# EAGLE schematic axiom_beta_interface_dummy_v0.8 (EAGLE 7.0.0)

## Sheet 1 of 2
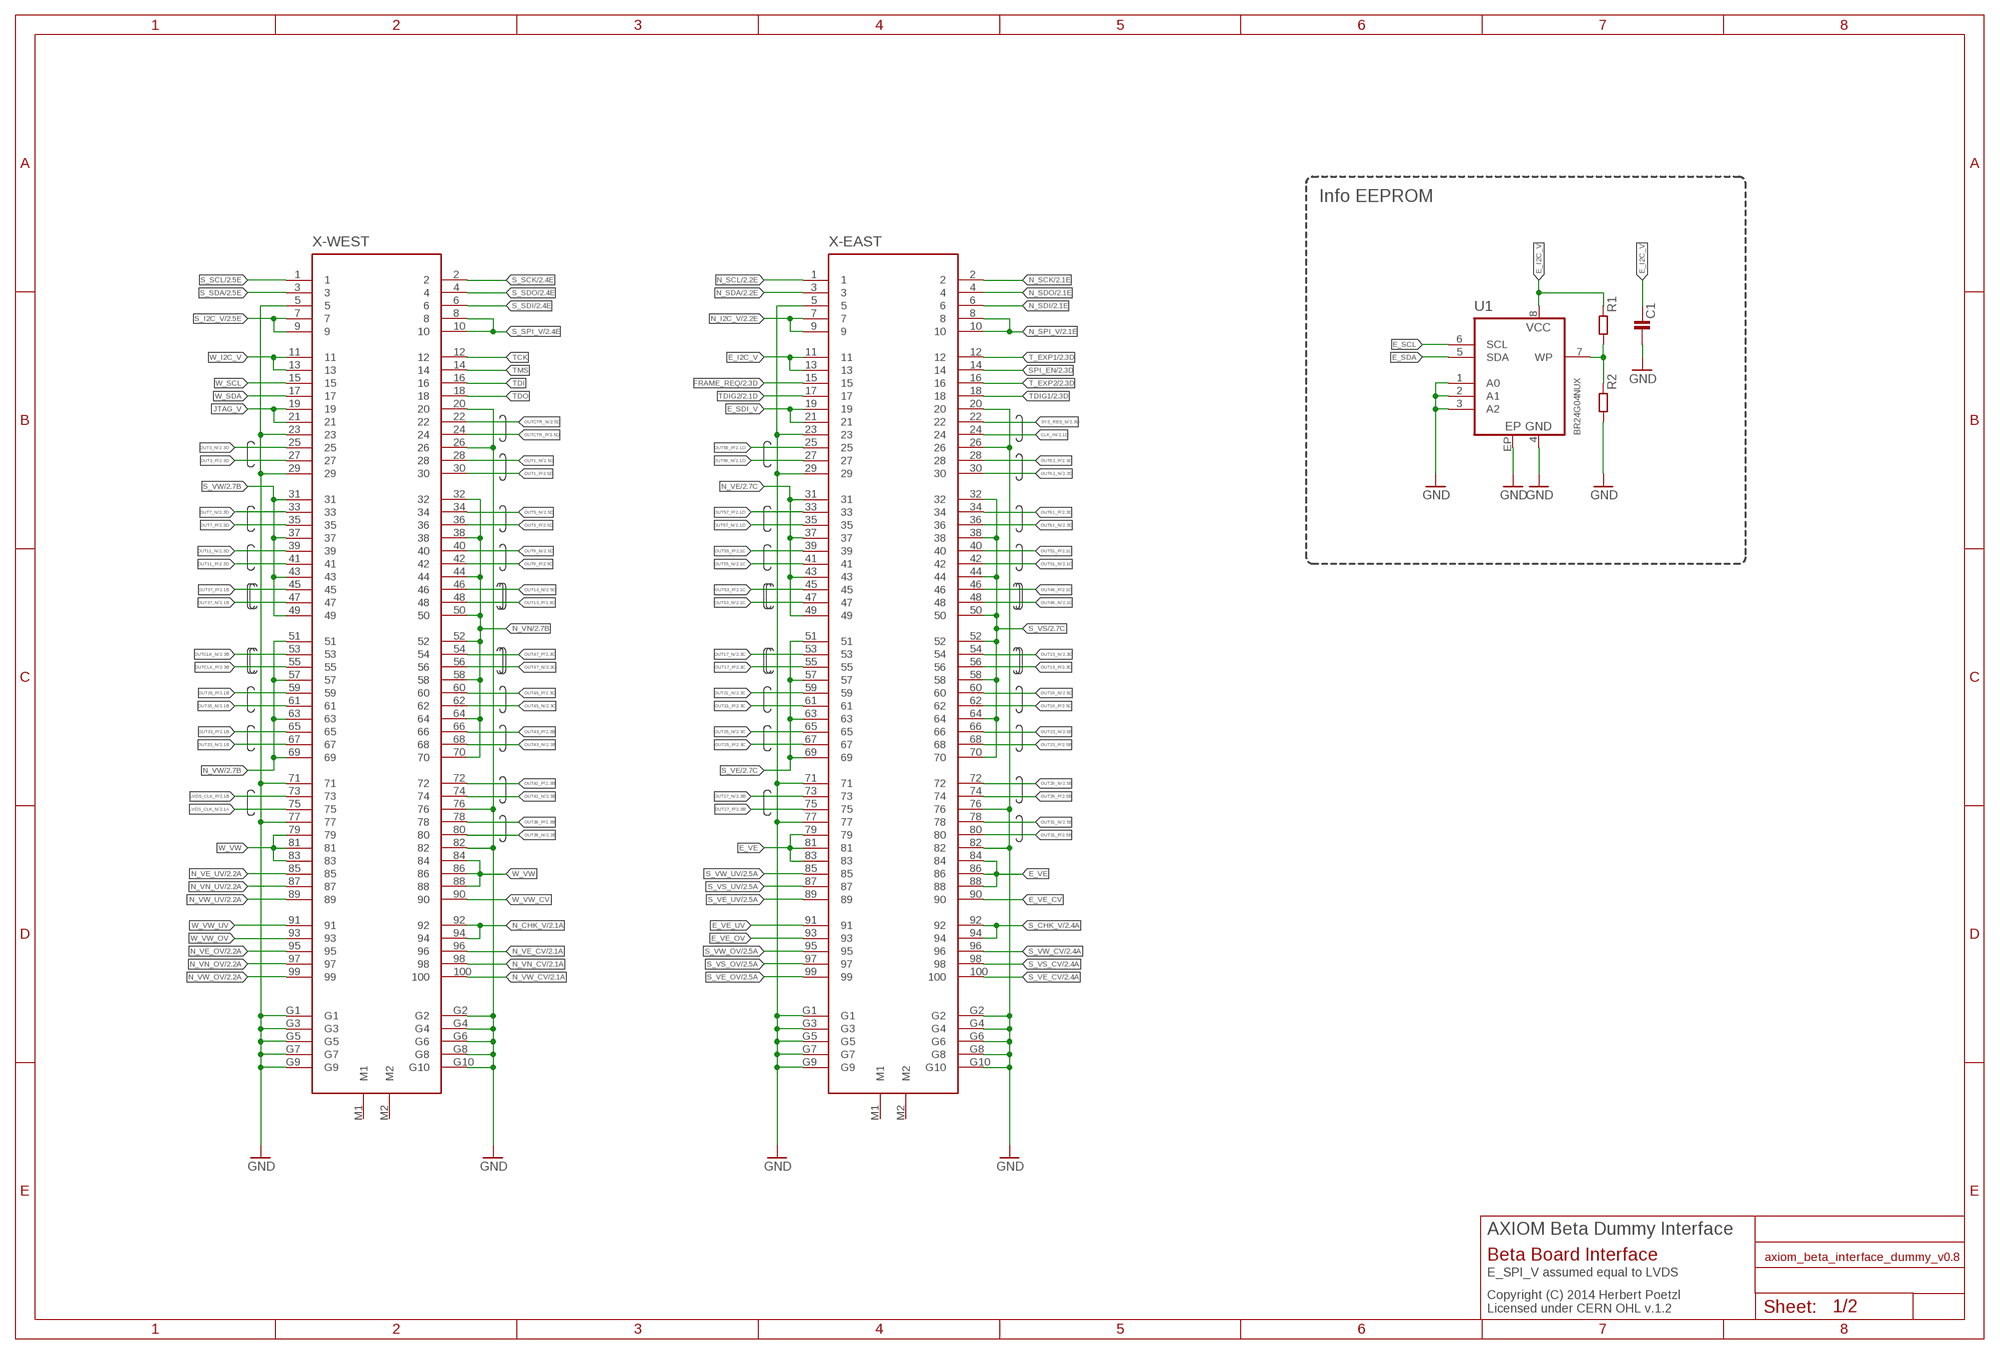
[diagram p0: schematic, sheet 1]

### Parts
C1  C0402-B  [0402-B]
R1  R0402-B  [0402-B]
R2  R0402-B  [0402-B]
U1  BR24G04NUX  [DFN200X300X100-9N]
X-EAST  FX10-100/10P  [FX10A-100P/10]
X-WEST  FX10-100/10P  [FX10A-100P/10]

### Nets
CLK_IN: X-EAST.24 ; also sheet 2
E_I2C_V: C1.1 R1.1 U1.8(VCC) X-EAST.11 X-EAST.13
E_SCL: U1.6(SCL)
E_SDA: U1.5(SDA)
E_SDI_V: X-EAST.19 X-EAST.21
E_VE: X-EAST.79 X-EAST.81 X-EAST.83 X-EAST.84 X-EAST.86 X-EAST.88
E_VE_CV: X-EAST.90
E_VE_OV: X-EAST.93
E_VE_UV: X-EAST.91
FRAME_REQ: X-EAST.15 ; also sheet 2
GND [power]: C1.2 R2.2 U1.1(A0) U1.2(A1) U1.3(A2) U1.4(GND) U1.EP X-EAST.5 X-EAST.20 X-EAST.23 X-EAST.26 X-EAST.29 X-EAST.71 X-EAST.76 X-EAST.77 X-EAST.82 X-EAST.G1 X-EAST.G2 X-EAST.G3 X-EAST.G4 X-EAST.G5 X-EAST.G6 X-EAST.G7 X-EAST.G8 X-EAST.G9 X-EAST.G10 X-WEST.5 X-WEST.20 X-WEST.23 X-WEST.26 X-WEST.29 X-WEST.71 X-WEST.76 X-WEST.77 X-WEST.82 X-WEST.G1 X-WEST.G2 X-WEST.G3 X-WEST.G4 X-WEST.G5 X-WEST.G6 X-WEST.G7 X-WEST.G8 X-WEST.G9 X-WEST.G10 ; also sheet 2
JTAG_V: X-WEST.19 X-WEST.21
LVDS_CLK_N: X-WEST.75 ; also sheet 2
LVDS_CLK_P: X-WEST.73 ; also sheet 2
N$12: R1.2 R2.1 U1.7(WP)
N_CHK_V: X-WEST.92 X-WEST.94 ; also sheet 2
N_I2C_V: X-EAST.7 X-EAST.9 ; also sheet 2
N_SCK: X-EAST.2 ; also sheet 2
N_SCL: X-EAST.1 ; also sheet 2
N_SDA: X-EAST.3 ; also sheet 2
N_SDI: X-EAST.6 ; also sheet 2
N_SDO: X-EAST.4 ; also sheet 2
N_SPI_V: X-EAST.8 X-EAST.10 ; also sheet 2
N_VE [power]: X-EAST.31 X-EAST.37 X-EAST.43 X-EAST.49 ; also sheet 2
N_VE_CV: X-WEST.96 ; also sheet 2
N_VE_OV: X-WEST.95 ; also sheet 2
N_VE_UV: X-WEST.85 ; also sheet 2
N_VN [power]: X-WEST.32 X-WEST.38 X-WEST.44 X-WEST.50 X-WEST.52 X-WEST.58 X-WEST.64 X-WEST.70 ; also sheet 2
N_VN_CV: X-WEST.98 ; also sheet 2
N_VN_OV: X-WEST.97 ; also sheet 2
N_VN_UV: X-WEST.87 ; also sheet 2
N_VW [power]: X-WEST.51 X-WEST.57 X-WEST.63 X-WEST.69 ; also sheet 2
N_VW_CV: X-WEST.100 ; also sheet 2
N_VW_OV: X-WEST.99 ; also sheet 2
N_VW_UV: X-WEST.89 ; also sheet 2
OUT1_N: X-WEST.28 ; also sheet 2
OUT1_P: X-WEST.30 ; also sheet 2
OUT3_N: X-WEST.25 ; also sheet 2
OUT3_P: X-WEST.27 ; also sheet 2
OUT5_N: X-WEST.34 ; also sheet 2
OUT5_P: X-WEST.36 ; also sheet 2
OUT7_N: X-WEST.33 ; also sheet 2
OUT7_P: X-WEST.35 ; also sheet 2
OUT9_N: X-WEST.40 ; also sheet 2
OUT9_P: X-WEST.42 ; also sheet 2
OUT11_N: X-WEST.39 ; also sheet 2
OUT11_P: X-WEST.41 ; also sheet 2
OUT13_N: X-WEST.46 ; also sheet 2
OUT13_P: X-WEST.48 ; also sheet 2
OUT15_N: X-EAST.54 ; also sheet 2
OUT15_P: X-EAST.56 ; also sheet 2
OUT17_N: X-EAST.53 ; also sheet 2
OUT17_P: X-EAST.55 ; also sheet 2
OUT19_N: X-EAST.60 ; also sheet 2
OUT19_P: X-EAST.62 ; also sheet 2
OUT21_N: X-EAST.59 ; also sheet 2
OUT21_P: X-EAST.61 ; also sheet 2
OUT23_N: X-EAST.66 ; also sheet 2
OUT23_P: X-EAST.68 ; also sheet 2
OUT25_N: X-EAST.65 ; also sheet 2
OUT25_P: X-EAST.67 ; also sheet 2
OUT27_N: X-EAST.73 ; also sheet 2
OUT27_P: X-EAST.75 ; also sheet 2
OUT29_N: X-EAST.72 ; also sheet 2
OUT29_P: X-EAST.74 ; also sheet 2
OUT31_N: X-EAST.78 ; also sheet 2
OUT31_P: X-EAST.80 ; also sheet 2
OUT33_N: X-WEST.67 ; also sheet 2
OUT33_P: X-WEST.65 ; also sheet 2
OUT35_N: X-WEST.61 ; also sheet 2
OUT35_P: X-WEST.59 ; also sheet 2
OUT37_N: X-WEST.47 ; also sheet 2
OUT37_P: X-WEST.45 ; also sheet 2
OUT39_N: X-WEST.80 ; also sheet 2
OUT39_P: X-WEST.78 ; also sheet 2
OUT41_N: X-WEST.74 ; also sheet 2
OUT41_P: X-WEST.72 ; also sheet 2
OUT43_N: X-WEST.68 ; also sheet 2
OUT43_P: X-WEST.66 ; also sheet 2
OUT45_N: X-WEST.62 ; also sheet 2
OUT45_P: X-WEST.60 ; also sheet 2
OUT47_N: X-WEST.56 ; also sheet 2
OUT47_P: X-WEST.54 ; also sheet 2
OUT49_N: X-EAST.48 ; also sheet 2
OUT49_P: X-EAST.46 ; also sheet 2
OUT51_N: X-EAST.42 ; also sheet 2
OUT51_P: X-EAST.40 ; also sheet 2
OUT53_N: X-EAST.47 ; also sheet 2
OUT53_P: X-EAST.45 ; also sheet 2
OUT55_N: X-EAST.41 ; also sheet 2
OUT55_P: X-EAST.39 ; also sheet 2
OUT57_N: X-EAST.35 ; also sheet 2
OUT57_P: X-EAST.33 ; also sheet 2
OUT59_N: X-EAST.27 ; also sheet 2
OUT59_P: X-EAST.25 ; also sheet 2
OUT61_N: X-EAST.36 ; also sheet 2
OUT61_P: X-EAST.34 ; also sheet 2
OUT63_N: X-EAST.30 ; also sheet 2
OUT63_P: X-EAST.28 ; also sheet 2
OUTCLK_N: X-WEST.53 ; also sheet 2
OUTCLK_P: X-WEST.55 ; also sheet 2
OUTCTR_N: X-WEST.22 ; also sheet 2
OUTCTR_P: X-WEST.24 ; also sheet 2
S_CHK_V: X-EAST.92 X-EAST.94 ; also sheet 2
S_I2C_V: X-WEST.7 X-WEST.9 ; also sheet 2
S_SCK: X-WEST.2 ; also sheet 2
S_SCL: X-WEST.1 ; also sheet 2
S_SDA: X-WEST.3 ; also sheet 2
S_SDI: X-WEST.6 ; also sheet 2
S_SDO: X-WEST.4 ; also sheet 2
S_SPI_V: X-WEST.8 X-WEST.10 ; also sheet 2
S_VE [power]: X-EAST.51 X-EAST.57 X-EAST.63 X-EAST.69 ; also sheet 2
S_VE_CV: X-EAST.100 ; also sheet 2
S_VE_OV: X-EAST.99 ; also sheet 2
S_VE_UV: X-EAST.89 ; also sheet 2
S_VS [power]: X-EAST.32 X-EAST.38 X-EAST.44 X-EAST.50 X-EAST.52 X-EAST.58 X-EAST.64 X-EAST.70 ; also sheet 2
S_VS_CV: X-EAST.98 ; also sheet 2
S_VS_OV: X-EAST.97 ; also sheet 2
S_VS_UV: X-EAST.87 ; also sheet 2
S_VW [power]: X-WEST.31 X-WEST.37 X-WEST.43 X-WEST.49 ; also sheet 2
S_VW_CV: X-EAST.96 ; also sheet 2
S_VW_OV: X-EAST.95 ; also sheet 2
S_VW_UV: X-EAST.85 ; also sheet 2
SPI_EN: X-EAST.14 ; also sheet 2
SYS_RES_N: X-EAST.22 ; also sheet 2
T_EXP1: X-EAST.12 ; also sheet 2
T_EXP2: X-EAST.16 ; also sheet 2
TCK: X-WEST.12
TDI: X-WEST.16
TDIG1: X-EAST.18 ; also sheet 2
TDIG2: X-EAST.17 ; also sheet 2
TDO: X-WEST.18
TMS: X-WEST.14
W_I2C_V: X-WEST.11 X-WEST.13
W_SCL: X-WEST.15
W_SDA: X-WEST.17
W_VW: X-WEST.79 X-WEST.81 X-WEST.83 X-WEST.84 X-WEST.86 X-WEST.88
W_VW_CV: X-WEST.90
W_VW_OV: X-WEST.93
W_VW_UV: X-WEST.91
Unconnected: X-EAST.M1 X-EAST.M2 X-WEST.M1 X-WEST.M2

### Notes on the sheet
- Info EEPROM
- AXIOM Beta Dummy Interface
- Beta Board Interface
- E_SPI_V assumed equal to LVDS
- Copyright (C) 2014 Herbert Poetzl
  Licensed under CERN OHL v.1.2

## Sheet 2 of 2
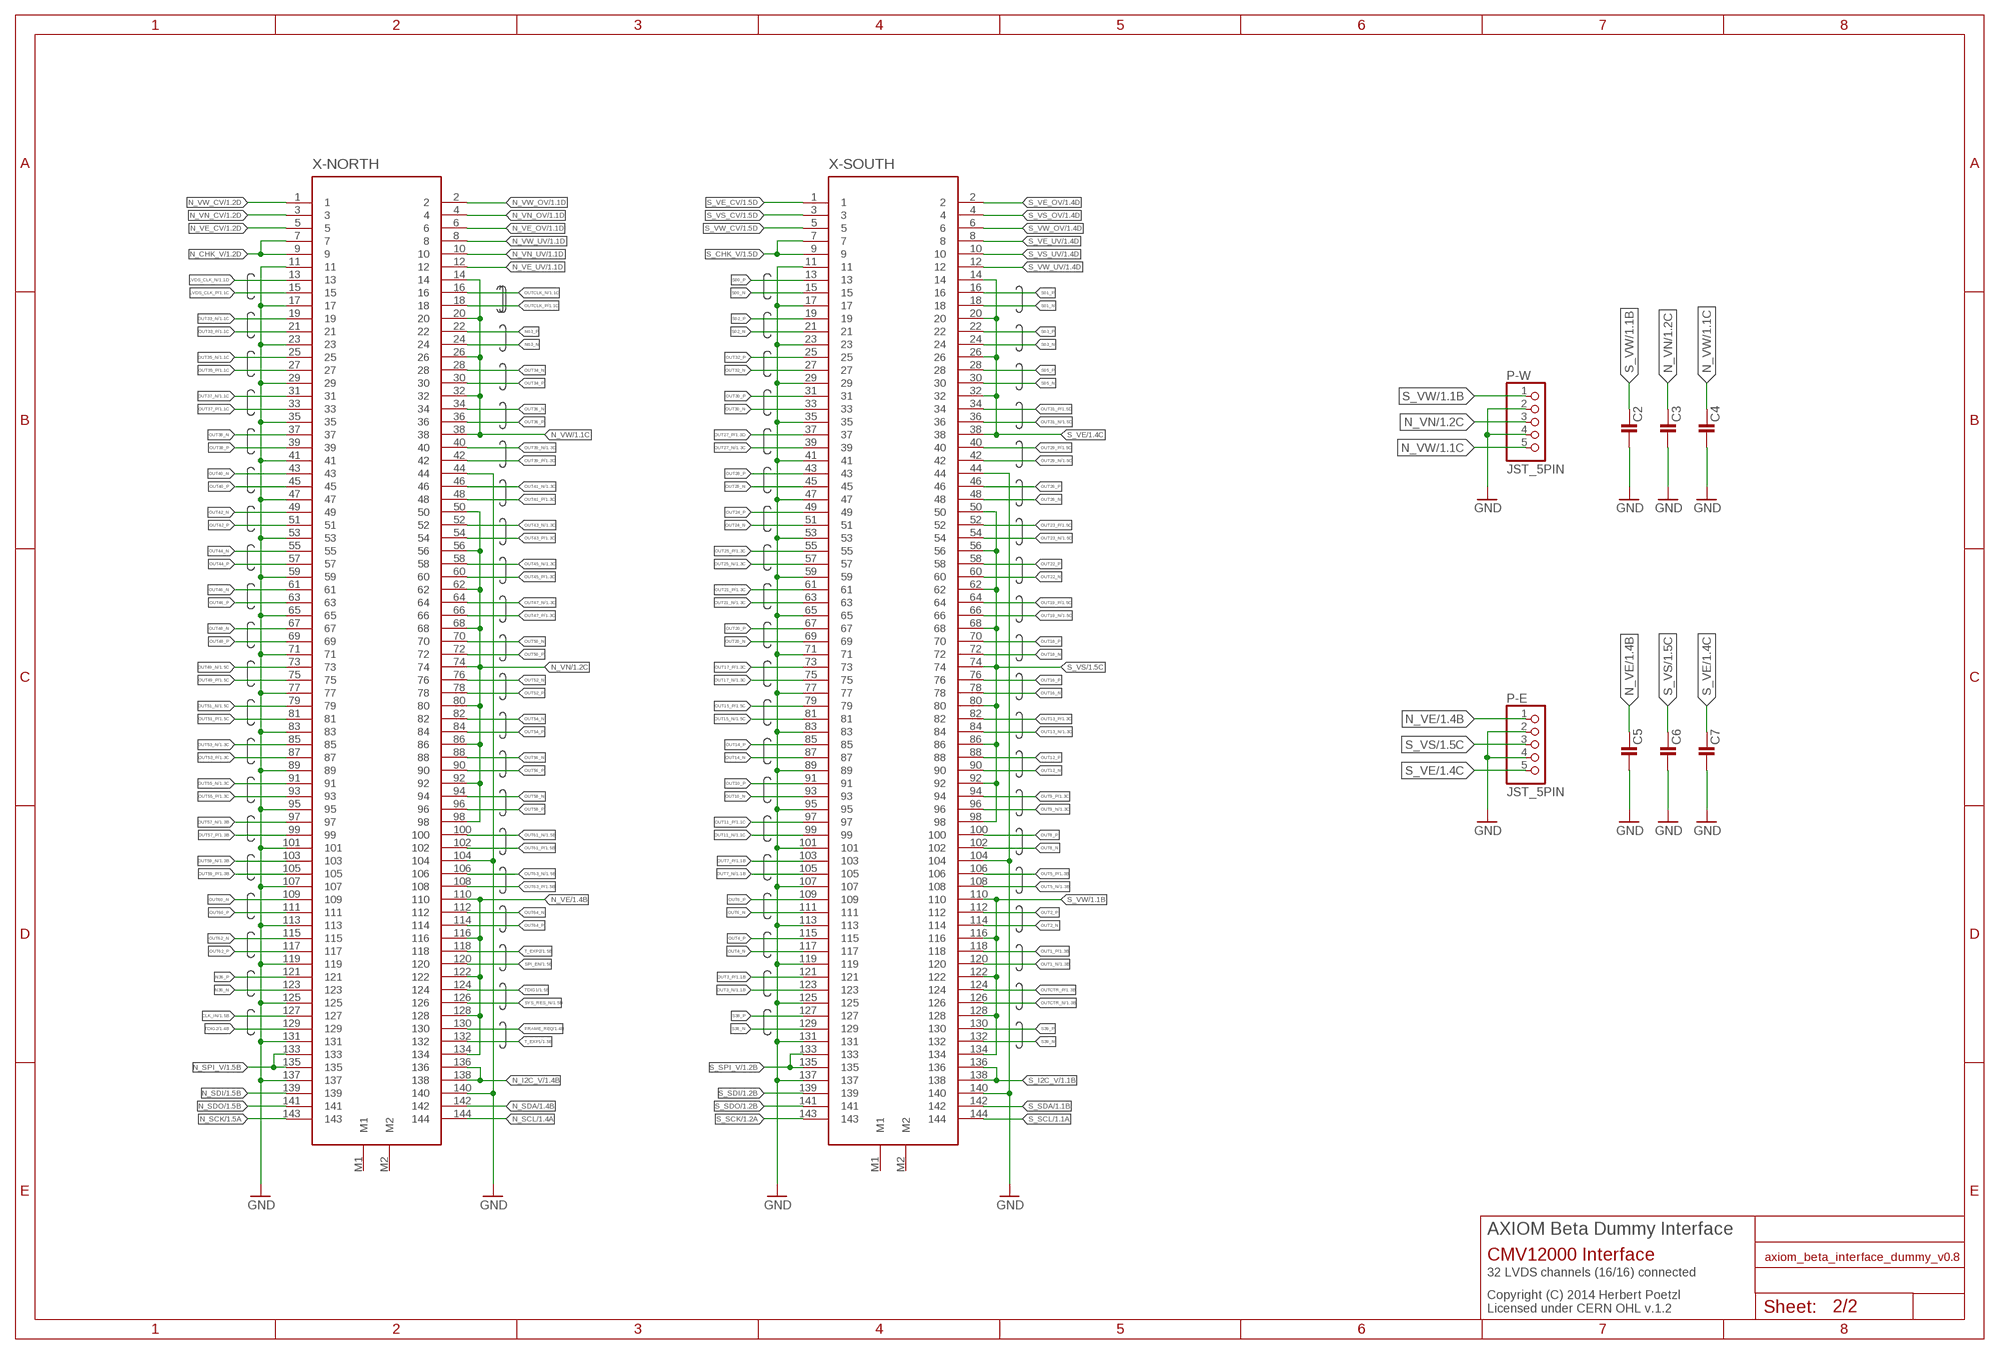
[diagram p1: schematic, sheet 2]

### Parts
C2  C1206-B  [1206-B]
C3  C1206-B  [1206-B]
C4  C1206-B  [1206-B]
C5  C1206-B  [1206-B]
C6  C1206-B  [1206-B]
C7  C1206-B  [1206-B]
P-E  JST_5PIN  [JST-PH-5-SMT-RA]
P-W  JST_5PIN  [JST-PH-5-SMT-RA]
X-NORTH  FX10-144S  [FX10A-144S]
X-SOUTH  FX10-144S  [FX10A-144S]

### Nets
CLK_IN: X-NORTH.127 ; also sheet 1
FRAME_REQ: X-NORTH.130 ; also sheet 1
GND [power]: C2.2 C3.2 C4.2 C5.2 C6.2 C7.2 P-E.2 P-E.4 P-W.2 P-W.4 X-NORTH.11 X-NORTH.17 X-NORTH.23 X-NORTH.29 X-NORTH.35 X-NORTH.41 X-NORTH.44 X-NORTH.47 X-NORTH.53 X-NORTH.59 X-NORTH.65 X-NORTH.71 X-NORTH.77 X-NORTH.83 X-NORTH.89 X-NORTH.95 X-NORTH.101 X-NORTH.104 X-NORTH.107 X-NORTH.113 X-NORTH.119 X-NORTH.125 X-NORTH.131 X-NORTH.137 X-NORTH.140 X-SOUTH.11 X-SOUTH.17 X-SOUTH.23 X-SOUTH.29 X-SOUTH.35 X-SOUTH.41 X-SOUTH.44 X-SOUTH.47 X-SOUTH.53 X-SOUTH.59 X-SOUTH.65 X-SOUTH.71 X-SOUTH.77 X-SOUTH.83 X-SOUTH.89 X-SOUTH.95 X-SOUTH.101 X-SOUTH.104 X-SOUTH.107 X-SOUTH.113 X-SOUTH.119 X-SOUTH.125 X-SOUTH.131 X-SOUTH.137 X-SOUTH.140 ; also sheet 1
LVDS_CLK_N: X-NORTH.13 ; also sheet 1
LVDS_CLK_P: X-NORTH.15 ; also sheet 1
N03_N: X-NORTH.24
N03_P: X-NORTH.22
N36_N: X-NORTH.123
N36_P: X-NORTH.121
N_CHK_V: X-NORTH.7 X-NORTH.9 ; also sheet 1
N_I2C_V: X-NORTH.136 X-NORTH.138 ; also sheet 1
N_SCK: X-NORTH.143 ; also sheet 1
N_SCL: X-NORTH.144 ; also sheet 1
N_SDA: X-NORTH.142 ; also sheet 1
N_SDI: X-NORTH.139 ; also sheet 1
N_SDO: X-NORTH.141 ; also sheet 1
N_SPI_V: X-NORTH.133 X-NORTH.135 ; also sheet 1
N_VE [power]: C5.1 P-E.1 X-NORTH.110 X-NORTH.116 X-NORTH.122 X-NORTH.128 X-NORTH.134 ; also sheet 1
N_VE_CV: X-NORTH.5 ; also sheet 1
N_VE_OV: X-NORTH.6 ; also sheet 1
N_VE_UV: X-NORTH.12 ; also sheet 1
N_VN [power]: C3.1 P-W.3 X-NORTH.50 X-NORTH.56 X-NORTH.62 X-NORTH.68 X-NORTH.74 X-NORTH.80 X-NORTH.86 X-NORTH.92 X-NORTH.98 ; also sheet 1
N_VN_CV: X-NORTH.3 ; also sheet 1
N_VN_OV: X-NORTH.4 ; also sheet 1
N_VN_UV: X-NORTH.10 ; also sheet 1
N_VW [power]: C4.1 P-W.5 X-NORTH.14 X-NORTH.20 X-NORTH.26 X-NORTH.32 X-NORTH.38 ; also sheet 1
N_VW_CV: X-NORTH.1 ; also sheet 1
N_VW_OV: X-NORTH.2 ; also sheet 1
N_VW_UV: X-NORTH.8 ; also sheet 1
OUT1_N: X-SOUTH.120 ; also sheet 1
OUT1_P: X-SOUTH.118 ; also sheet 1
OUT2_N: X-SOUTH.114
OUT2_P: X-SOUTH.112
OUT3_N: X-SOUTH.123 ; also sheet 1
OUT3_P: X-SOUTH.121 ; also sheet 1
OUT4_N: X-SOUTH.117
OUT4_P: X-SOUTH.115
OUT5_N: X-SOUTH.108 ; also sheet 1
OUT5_P: X-SOUTH.106 ; also sheet 1
OUT6_N: X-SOUTH.111
OUT6_P: X-SOUTH.109
OUT7_N: X-SOUTH.105 ; also sheet 1
OUT7_P: X-SOUTH.103 ; also sheet 1
OUT8_N: X-SOUTH.102
OUT8_P: X-SOUTH.100
OUT9_N: X-SOUTH.96 ; also sheet 1
OUT9_P: X-SOUTH.94 ; also sheet 1
OUT10_N: X-SOUTH.93
OUT10_P: X-SOUTH.91
OUT11_N: X-SOUTH.99 ; also sheet 1
OUT11_P: X-SOUTH.97 ; also sheet 1
OUT12_N: X-SOUTH.90
OUT12_P: X-SOUTH.88
OUT13_N: X-SOUTH.84 ; also sheet 1
OUT13_P: X-SOUTH.82 ; also sheet 1
OUT14_N: X-SOUTH.87
OUT14_P: X-SOUTH.85
OUT15_N: X-SOUTH.81 ; also sheet 1
OUT15_P: X-SOUTH.79 ; also sheet 1
OUT16_N: X-SOUTH.78
OUT16_P: X-SOUTH.76
OUT17_N: X-SOUTH.75 ; also sheet 1
OUT17_P: X-SOUTH.73 ; also sheet 1
OUT18_N: X-SOUTH.72
OUT18_P: X-SOUTH.70
OUT19_N: X-SOUTH.66 ; also sheet 1
OUT19_P: X-SOUTH.64 ; also sheet 1
OUT20_N: X-SOUTH.69
OUT20_P: X-SOUTH.67
OUT21_N: X-SOUTH.63 ; also sheet 1
OUT21_P: X-SOUTH.61 ; also sheet 1
OUT22_N: X-SOUTH.60
OUT22_P: X-SOUTH.58
OUT23_N: X-SOUTH.54 ; also sheet 1
OUT23_P: X-SOUTH.52 ; also sheet 1
OUT24_N: X-SOUTH.51
OUT24_P: X-SOUTH.49
OUT25_N: X-SOUTH.57 ; also sheet 1
OUT25_P: X-SOUTH.55 ; also sheet 1
OUT26_N: X-SOUTH.48
OUT26_P: X-SOUTH.46
OUT27_N: X-SOUTH.39 ; also sheet 1
OUT27_P: X-SOUTH.37 ; also sheet 1
OUT28_N: X-SOUTH.45
OUT28_P: X-SOUTH.43
OUT29_N: X-SOUTH.42 ; also sheet 1
OUT29_P: X-SOUTH.40 ; also sheet 1
OUT30_N: X-SOUTH.33
OUT30_P: X-SOUTH.31
OUT31_N: X-SOUTH.36 ; also sheet 1
OUT31_P: X-SOUTH.34 ; also sheet 1
OUT32_N: X-SOUTH.27
OUT32_P: X-SOUTH.25
OUT33_N: X-NORTH.19 ; also sheet 1
OUT33_P: X-NORTH.21 ; also sheet 1
OUT34_N: X-NORTH.28
OUT34_P: X-NORTH.30
OUT35_N: X-NORTH.25 ; also sheet 1
OUT35_P: X-NORTH.27 ; also sheet 1
OUT36_N: X-NORTH.34
OUT36_P: X-NORTH.36
OUT37_N: X-NORTH.31 ; also sheet 1
OUT37_P: X-NORTH.33 ; also sheet 1
OUT38_N: X-NORTH.37
OUT38_P: X-NORTH.39
OUT39_N: X-NORTH.40 ; also sheet 1
OUT39_P: X-NORTH.42 ; also sheet 1
OUT40_N: X-NORTH.43
OUT40_P: X-NORTH.45
OUT41_N: X-NORTH.46 ; also sheet 1
OUT41_P: X-NORTH.48 ; also sheet 1
OUT42_N: X-NORTH.49
OUT42_P: X-NORTH.51
OUT43_N: X-NORTH.52 ; also sheet 1
OUT43_P: X-NORTH.54 ; also sheet 1
OUT44_N: X-NORTH.55
OUT44_P: X-NORTH.57
OUT45_N: X-NORTH.58 ; also sheet 1
OUT45_P: X-NORTH.60 ; also sheet 1
OUT46_N: X-NORTH.61
OUT46_P: X-NORTH.63
OUT47_N: X-NORTH.64 ; also sheet 1
OUT47_P: X-NORTH.66 ; also sheet 1
OUT48_N: X-NORTH.67
OUT48_P: X-NORTH.69
OUT49_N: X-NORTH.73 ; also sheet 1
OUT49_P: X-NORTH.75 ; also sheet 1
OUT50_N: X-NORTH.70
OUT50_P: X-NORTH.72
OUT51_N: X-NORTH.79 ; also sheet 1
OUT51_P: X-NORTH.81 ; also sheet 1
OUT52_N: X-NORTH.76
OUT52_P: X-NORTH.78
OUT53_N: X-NORTH.85 ; also sheet 1
OUT53_P: X-NORTH.87 ; also sheet 1
OUT54_N: X-NORTH.82
OUT54_P: X-NORTH.84
OUT55_N: X-NORTH.91 ; also sheet 1
OUT55_P: X-NORTH.93 ; also sheet 1
OUT56_N: X-NORTH.88
OUT56_P: X-NORTH.90
OUT57_N: X-NORTH.97 ; also sheet 1
OUT57_P: X-NORTH.99 ; also sheet 1
OUT58_N: X-NORTH.94
OUT58_P: X-NORTH.96
OUT59_N: X-NORTH.103 ; also sheet 1
OUT59_P: X-NORTH.105 ; also sheet 1
OUT60_N: X-NORTH.109
OUT60_P: X-NORTH.111
OUT61_N: X-NORTH.100 ; also sheet 1
OUT61_P: X-NORTH.102 ; also sheet 1
OUT62_N: X-NORTH.115
OUT62_P: X-NORTH.117
OUT63_N: X-NORTH.106 ; also sheet 1
OUT63_P: X-NORTH.108 ; also sheet 1
OUT64_N: X-NORTH.112
OUT64_P: X-NORTH.114
OUTCLK_N: X-NORTH.16 ; also sheet 1
OUTCLK_P: X-NORTH.18 ; also sheet 1
OUTCTR_N: X-SOUTH.126 ; also sheet 1
OUTCTR_P: X-SOUTH.124 ; also sheet 1
S00_N: X-SOUTH.15
S00_P: X-SOUTH.13
S01_N: X-SOUTH.18
S01_P: X-SOUTH.16
S02_N: X-SOUTH.21
S02_P: X-SOUTH.19
S03_N: X-SOUTH.24
S03_P: X-SOUTH.22
S05_N: X-SOUTH.30
S05_P: X-SOUTH.28
S38_N: X-SOUTH.129
S38_P: X-SOUTH.127
S39_N: X-SOUTH.132
S39_P: X-SOUTH.130
S_CHK_V: X-SOUTH.7 X-SOUTH.9 ; also sheet 1
S_I2C_V: X-SOUTH.136 X-SOUTH.138 ; also sheet 1
S_SCK: X-SOUTH.143 ; also sheet 1
S_SCL: X-SOUTH.144 ; also sheet 1
S_SDA: X-SOUTH.142 ; also sheet 1
S_SDI: X-SOUTH.139 ; also sheet 1
S_SDO: X-SOUTH.141 ; also sheet 1
S_SPI_V: X-SOUTH.133 X-SOUTH.135 ; also sheet 1
S_VE [power]: C7.1 P-E.5 X-SOUTH.14 X-SOUTH.20 X-SOUTH.26 X-SOUTH.32 X-SOUTH.38 ; also sheet 1
S_VE_CV: X-SOUTH.1 ; also sheet 1
S_VE_OV: X-SOUTH.2 ; also sheet 1
S_VE_UV: X-SOUTH.8 ; also sheet 1
S_VS [power]: C6.1 P-E.3 X-SOUTH.50 X-SOUTH.56 X-SOUTH.62 X-SOUTH.68 X-SOUTH.74 X-SOUTH.80 X-SOUTH.86 X-SOUTH.92 X-SOUTH.98 ; also sheet 1
S_VS_CV: X-SOUTH.3 ; also sheet 1
S_VS_OV: X-SOUTH.4 ; also sheet 1
S_VS_UV: X-SOUTH.10 ; also sheet 1
S_VW [power]: C2.1 P-W.1 X-SOUTH.110 X-SOUTH.116 X-SOUTH.122 X-SOUTH.128 X-SOUTH.134 ; also sheet 1
S_VW_CV: X-SOUTH.5 ; also sheet 1
S_VW_OV: X-SOUTH.6 ; also sheet 1
S_VW_UV: X-SOUTH.12 ; also sheet 1
SPI_EN: X-NORTH.120 ; also sheet 1
SYS_RES_N: X-NORTH.126 ; also sheet 1
T_EXP1: X-NORTH.132 ; also sheet 1
T_EXP2: X-NORTH.118 ; also sheet 1
TDIG1: X-NORTH.124 ; also sheet 1
TDIG2: X-NORTH.129 ; also sheet 1
Unconnected: X-NORTH.M1 X-NORTH.M2 X-SOUTH.M1 X-SOUTH.M2

### Notes on the sheet
- AXIOM Beta Dummy Interface
- CMV12000 Interface
- 32 LVDS channels (16/16) connected
- Copyright (C) 2014 Herbert Poetzl
  Licensed under CERN OHL v.1.2

## Library data of the parts
C1-C7 = generic-rcl:C
P-E P-W = jst-ph:JST_5PIN
R1 R2 = generic-rcl:R
U1 = eeprom:BR24G04
X-EAST X-WEST = fx10:FX10-100/10
X-NORTH X-SOUTH = fx10:FX10-144

## Net classes
0 default: width 0.152 mm, drill 0.254 mm
1 power: width 0.152 mm, drill 0.254 mm